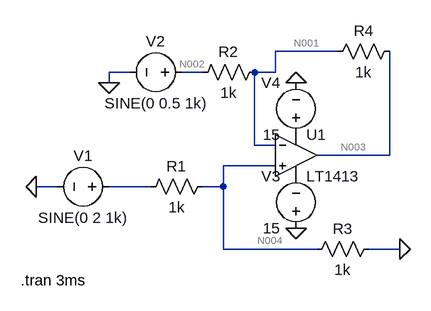
[diagram p0: schematic EXP-6_VoltageSubstractor.asc]
EXP-6_VoltageSubstractor.asc, the LTspice schematic file:
Version 4
SHEET 1 880 680
WIRE 240 -32 144 -32
WIRE -80 0 -112 0
WIRE 32 0 0 0
WIRE 144 0 144 -32
WIRE 144 0 112 0
WIRE -112 16 -112 0
WIRE 112 112 112 0
WIRE 144 112 112 112
WIRE 320 128 320 -32
WIRE 320 128 208 128
WIRE 144 144 64 144
WIRE -192 176 -224 176
WIRE -48 176 -112 176
WIRE 64 176 64 144
WIRE 64 176 32 176
WIRE 64 272 64 176
WIRE 208 272 64 272
WIRE 336 272 288 272
FLAG -224 176 0
FLAG -112 16 0
FLAG 176 16 0
FLAG 176 240 0
FLAG 336 272 0
SYMBOL voltage -96 176 R90
WINDOW 0 -32 56 VBottom 2
WINDOW 3 32 56 VTop 2
WINDOW 123 0 0 Left 0
WINDOW 39 0 0 Left 0
SYMATTR InstName V1
SYMATTR Value SINE(0 2 1k)
SYMBOL voltage 16 0 R90
WINDOW 0 -32 56 VBottom 2
WINDOW 3 32 56 VTop 2
WINDOW 123 0 0 Left 0
WINDOW 39 0 0 Left 0
SYMATTR InstName V2
SYMATTR Value SINE(0 0.5 1k)
SYMBOL res 48 160 R90
WINDOW 0 0 56 VBottom 2
WINDOW 3 32 56 VTop 2
SYMATTR InstName R1
SYMATTR Value 1k
SYMBOL res 128 -16 R90
WINDOW 0 0 56 VBottom 2
WINDOW 3 32 56 VTop 2
SYMATTR InstName R2
SYMATTR Value 1k
SYMBOL res 304 256 R90
WINDOW 0 0 56 VBottom 2
WINDOW 3 32 56 VTop 2
SYMATTR InstName R3
SYMATTR Value 1k
SYMBOL OpAmps\\LT1413 176 64 R0
SYMATTR InstName U1
SYMBOL voltage 176 256 R180
WINDOW 0 24 96 Left 2
WINDOW 3 24 16 Left 2
WINDOW 123 0 0 Left 0
WINDOW 39 0 0 Left 0
SYMATTR InstName V3
SYMATTR Value 15
SYMBOL voltage 176 112 R180
WINDOW 0 24 96 Left 2
WINDOW 3 24 16 Left 2
WINDOW 123 0 0 Left 0
WINDOW 39 0 0 Left 0
SYMATTR InstName V4
SYMATTR Value 15
SYMBOL res 336 -48 R90
WINDOW 0 0 56 VBottom 2
WINDOW 3 32 56 VTop 2
SYMATTR InstName R4
SYMATTR Value 1k
TEXT -248 320 Left 2 !.tran 3ms

The netlist it stands for:
* EXP-6_VoltageSubstractor.asc
V1 N005 0 SINE(0 2 1k)
V2 N002 0 SINE(0 0.5 1k)
R1 N004 N005 1k
R2 N001 N002 1k
R3 0 N004 1k
XU1 N004 N001 P001 P002 N003 LT1413  ; pins In+ In- V+ V- OUT
V3 0 P002 15
V4 P001 0 15
R4 N003 N001 1k
.tran 3ms
.lib LTC.lib
.backanno
.end

* Results of the author's LTspice run, read from the files saved beside the schematic
* Operating Point, zero values left out:
*   V(n004) = 6 µV
*   V(n001) = 6 µV
*   V(p001) = 15 V
*   V(p002) = -15 V
*   I(R4) = -6 nA
*   I(R3) = -6 nA
*   I(R2) = 6 nA
*   I(R1) = 6 nA
*   I(V4) = -350 µA
*   I(V3) = -350 µA
*   I(V2) = 6 nA
*   I(V1) = 6 nA
*   Ix(u1:1) = -12 nA
*   Ix(u1:2) = -12 nA
*   Ix(u1:3) = 350 µA
*   Ix(u1:4) = -350 µA
*   Ix(u1:5) = 6 nA
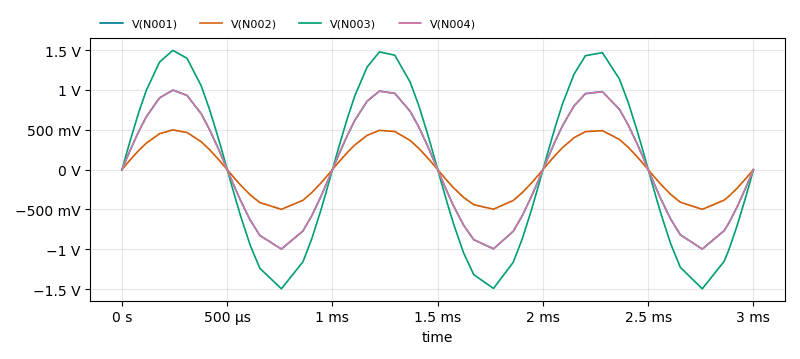
[diagram p1: Transient Analysis of EXP-6_VoltageSubstractor.asc, plotted from the saved traces]
* Transient Analysis, 1 run:
*   V(N001): min -998 mV, max 998.5 mV, average 3.032 mV, rms 697.3 mV, last -1.563 mV
*   V(N002): min -499 mV, max 499.3 mV, average 1.513 mV, rms 348.7 mV, last 0 V
*   V(N003): min -1.497 V, max 1.498 V, average 4.539 mV, rms 1.046 V, last -3.136 mV
*   V(N004): min -997.9 mV, max 998.6 mV, average 3.032 mV, rms 697.3 mV, last 5.37 µV